# Altium schematic sheet current_control_circuit.SchDoc
size A4
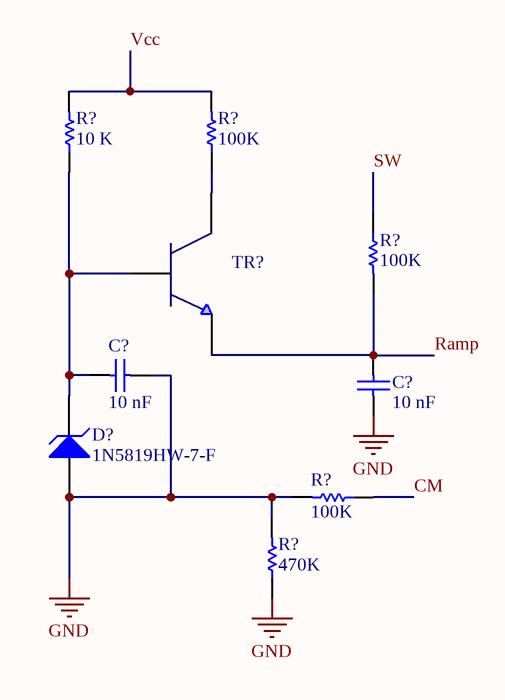
[diagram p0: current_control_circuit.SchDoc]

## Parts
(Parts that share a designator on the sheet are numbered #1, #2 ... from top to bottom, then left to right.)
C?#1  value 10 nF  [0402]  (hidden comment: GRM155R71E103JA01D)
C?#2  value 10 nF  [0402]  (hidden comment: GRM155R71E103JA01D)
D?  1N5819HW-7-F  [SOD123]
R?#1  value 10 K  [0603]  (hidden comment: ERJ3GEYJ103V)
R?#2  value 100K  [0603]  (hidden comment: MC0063W06031100K)
R?#3  value 100K  [0603]  (hidden comment: MC0063W06031100K)
R?#4  value 100K  [0603]  (hidden comment: MC0063W06031100K)
R?#5  value 470K  [0204]  (hidden comment: MMA02040C4703FB300)
TR?  Transistor  [SOT23_N]  (value not drawn)

## Nets
GND: C?#1.2 C?#2.1 D?.1(A) R?#4.2 R?#5.1 R?#5.2
CM: R?#4.1
Ramp: C?#2.2 R?#3.2 TR?.2
SW: R?#3.1
Vcc: R?#1.2 R?#2.2
NetC?#1_1: C?#1.1 D?.2(K) R?#1.1 TR?.1
NetR?#2_1: R?#2.1 TR?.3

## Library data of the parts
C?#1 C?#2 = GRM155R71E103JA01D: 10 nF X7R Ceremic Capacitor; Montaj Bilgisi: Otomatik; Published: 25.07.2016; LatestRevisionDate: 25.07.2016; Publisher: Sinan; PackageDescription: 0402[1005] package smd; Supplier: Farnell; Supplier No: 1572614RL
D? = 1N5819HW-7-F: Diode Schottky 40V 1A Surface Mount SOD-123; Published: 20.09.2019; Publisher: Baris; Manufacturer: 1N5819HW-7-F; Supplier No: 1N5819HW-FDICT-ND
R?#1 = ERJ3GEYJ103V: 10k ohm 0603 package resistor; Tolerance: 5%; Montaj Bilgisi: Otomatik; Published: 28.10.2015; LatestRevisionDate: 28.10.2015; Publisher: Sinan; PackageDescription: Surface mount 0603 package; Package Reference: 0603; Supplier: Digi-Key; Supplier No: P10KGTR-ND
R?#2-R?#4 = MC0063W06031100K: 100Kohm 0603package resistor; Montaj Bilgisi: Auto; Published: 14.04.2016; Publisher: Baris; PackageDescription: 0603 [1608]; Supplier: Farnell; Supplier No: 9330402
R?#5 = MMA02040C4703FB300: RES SMD 470K OHM 1% 0.4W 0204; Tolerance: %1; Published: 15.09.2019; LatestRevisionDate: 15.09.2019; Publisher: Baris; Package Reference: MELF, 0204; Supplier: Digikey; Supplier No: MMA-470KACT-ND
TR? = BC846ALT1G: Bipolar (BJT) Transistor NPN 65V 100mA 100MHz 300mW Surface Mount SOT-23-3 (TO-236); Montaj Bilgisi: Auto; Published: 25-12-2016; Publisher: Baris; Manufacturer Part Name: BC846ALT1G